# Altium project SDI-FIBER.PrjPcb
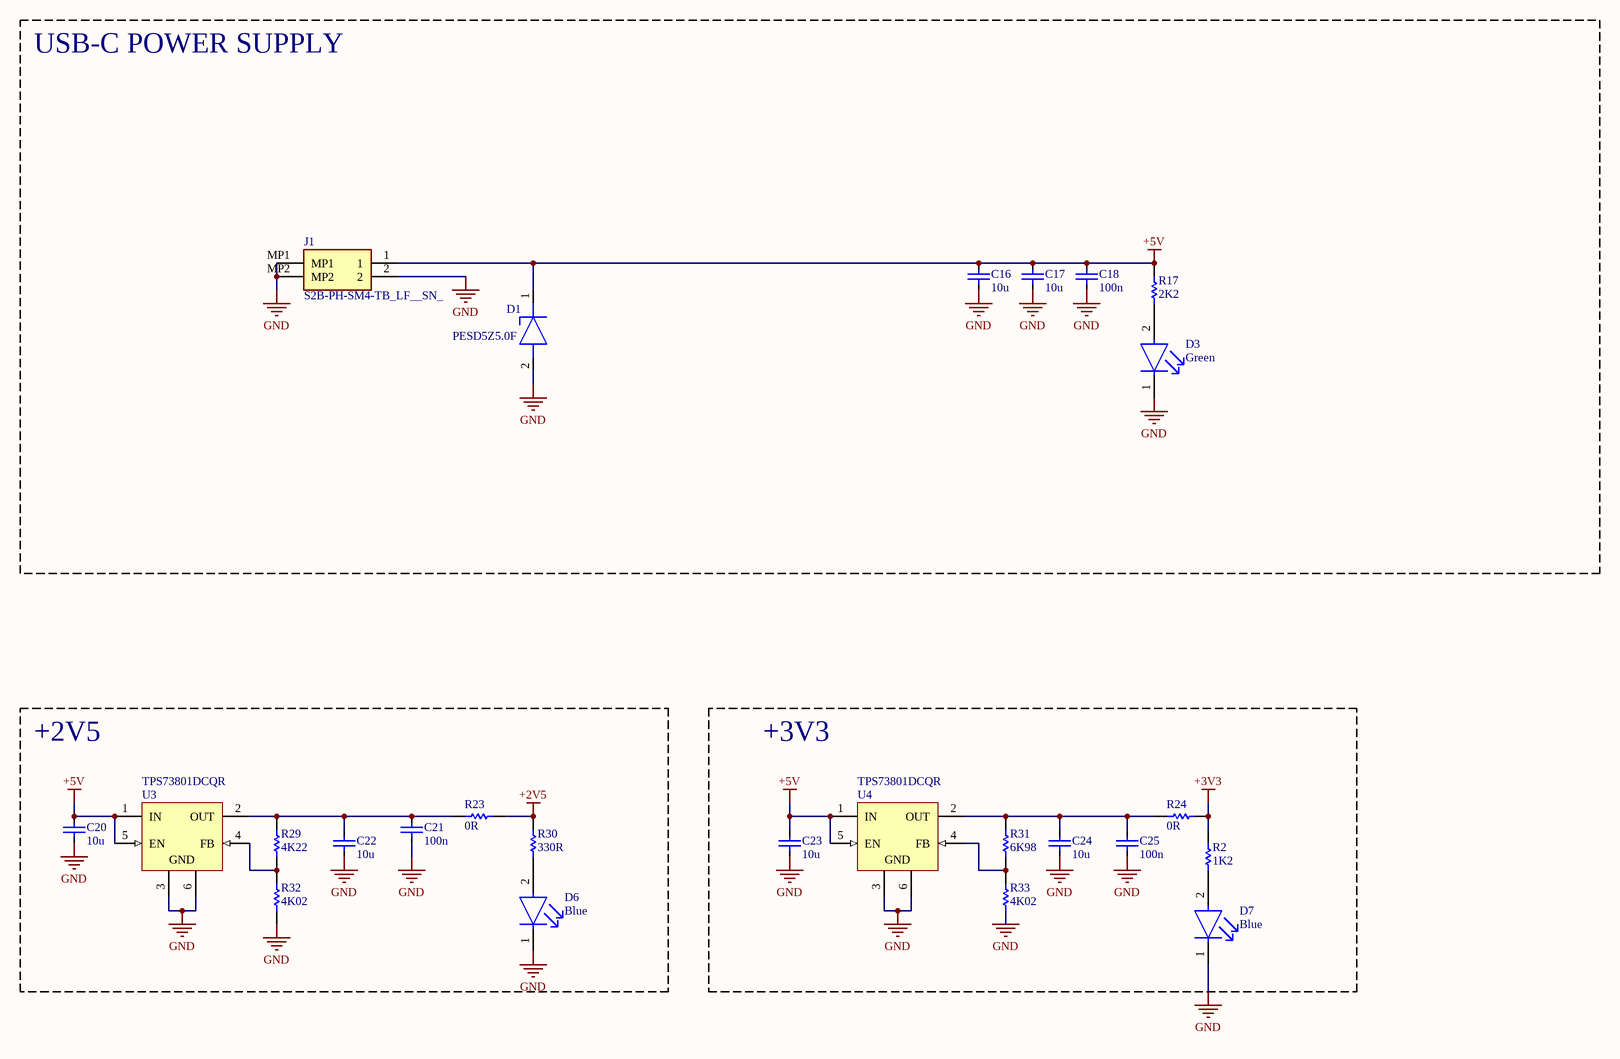
[diagram p0: POWER.SchDoc]
3 sheets, 109 parts. Net scope: global (net labels, ports and power ports of the same name join across sheets).
Board file: SDI-FIBER.PcbDoc
Sheets:
  POWER.SchDoc
  OPTIC.SchDoc
  CONVERTER.SchDoc

## Sheet POWER.SchDoc
size A3; SheetNumber: 1; SheetTotal: 3

### Parts
C16  value 10u  [FP-C1608-080-0_1-IPC_C]  (hidden comment: C1608JB0J106K080AB)
C17  value 10u  [FP-C1608-080-0_1-IPC_C]  (hidden comment: C1608JB0J106K080AB)
C18  value 100n  [FP-C1005-050-0_05-IPC_C]  (hidden comment: C1005X7R1H104K050BB)
C20  value 10u  [FP-C1608-080-0_1-IPC_C]  (hidden comment: C1608JB0J106K080AB)
C21  value 100n  [FP-C1005-050-0_05-IPC_C]  (hidden comment: C1005X7R1H104K050BB)
C22  value 10u  [FP-C1608-080-0_1-IPC_C]  (hidden comment: C1608JB0J106K080AB)
C23  value 10u  [FP-C1608-080-0_1-IPC_C]  (hidden comment: C1608JB0J106K080AB)
C24  value 10u  [FP-C1608-080-0_1-IPC_C]  (hidden comment: C1608JB0J106K080AB)
C25  value 100n  [FP-C1005-050-0_05-IPC_C]  (hidden comment: C1005X7R1H104K050BB)
D1  PESD5Z5.0F  [SODFL1608X65N]
D3  Color: Green  [FP-LTST-C191GKT-MFG]  (hidden comment: LTST-C191GKT)
D6  Color: Blue  [FP-LTST-C191TBKT-MFG]  (hidden comment: LTST-C191TBKT)
D7  Color: Blue  [FP-LTST-C191TBKT-MFG]  (hidden comment: LTST-C191TBKT)
J1  S2B-PH-SM4-TB_LF__SN_  [S2BPHSM4TBLFSN]
R2  value 1K2  [RESC1005X40X25ML05T10]  (hidden comment: RC0402FR-071K2L)
R17  value 2K2  [RESC1005X40X25NL05T10]  (hidden comment: RC0402FR-072K2L)
R23  value 0R  [RESC1005X40X25NL05T10]  (hidden comment: RC0402FR-070RL)
R24  value 0R  [RESC1005X40X25NL05T10]  (hidden comment: RC0402FR-070RL)
R29  value 4K22  [RESC1005X40X25ML05T10]  (hidden comment: RC0402FR-074K22L)
R30  value 330R  [RESC1005X40X25ML05T10]  (hidden comment: RC0402FR-07330RL)
R31  value 6K98  [RESC1005X40X25ML05T10]  (hidden comment: RC0402FR-076K98L)
R32  value 4K02  [RESC1005X40X25ML05T10]  (hidden comment: RC0402FR-074K02L)
R33  value 4K02  [RESC1005X40X25ML05T10]  (hidden comment: RC0402FR-074K02L)
U3  TPS73801DCQR  [DCQ0006A_L]
U4  TPS73801DCQR  [DCQ0006A_L]

### Blocks framed on the sheet
USB-C POWER SUPPLY: C16-C18 D1 D3 J1 R17
+2V5: C20-C22 D6 R23 R29 R30 R32 U3
+3V3: C23-C25 D7 R2 R24 R31 R33 U4

### Nets
+2V5: R23.1 R30.1
+3V3: R2.1 R24.1
+5V: C16.1 C17.1 C18.1 C20.1 C23.1 D1.1(K) J1.1 R17.1 U3.1(IN) U3.5(EN) U4.1(IN) U4.5(EN)
GND: C16.2 C17.2 C18.2 C20.2 C21.2 C22.2 C23.2 C24.2 C25.2 D1.2(A) D3.1(C) D6.1(C) D7.1(C) J1.2 J1.MP1 J1.MP2 R32.1 R33.1 U3.3(GND) U3.6(GND) U4.3(GND) U4.6(GND)
NetC21_1: C21.1 C22.1 R23.2 R29.1 U3.2(OUT)
NetC24_1: C24.1 C25.1 R24.2 R31.2 U4.2(OUT)
NetD3_2: D3.2(A) R17.2
NetD6_2: D6.2(A) R30.2
NetD7_2: D7.2(A) R2.2
NetR29_2: R29.2 R32.2 U3.4(FB)
NetR31_1: R31.1 R33.2 U4.4(FB)

### Library data of the parts
C16 C17 C20 C22-C24 = C1608JB0J106K080AB: MLCC 10μF ±10% 6.3V JB SMD 0603; Dielectric Material: Ceramic; Case Code (Imperial): 0603; Thickness: 0.035inch; Min Operating Temperature: -25°C; Termination: SMD/SMT; Lead Free: Lead Free; Resistor Type: Ceramic; Width: 0.8mm; Voltage Rating (DC): 6.3V; Package Quantity: 4000; Tolerance: 10%; Length: 0.063inch; Series: C; Height: 0.8mm; Max Operating Temperature: 85°C; Mount: Surface Mount; RoHS Compliant: Yes; Voltage Rating: 6.3V; Case Code (Metric): 1608; Case/Package: 0603; Packaging: Tape and Reel
C18 C21 C25 = C1005X7R1H104K050BB: MLCC 100nF ±10% 50V X7R SMD 0402; Dielectric Material: Ceramic; Voltage: 50V; Min Operating Temperature: -55°C; Depth: 0.5mm; Radiation Hardening: No; RoHS Compliant: Yes; Voltage Rating (DC): 50V; Lead Free: Lead Free; Resistor Type: Ceramic; Height: 0.5mm; Dielectric: X7R; Thickness: 0.022inch; Case/Package: 0402; Case Code (Metric): 1005; Termination: SMD/SMT; Packaging: Tape and Reel; Max Operating Temperature: 125°C; Mount: Surface Mount; Package Quantity: 1; Width: 0.02inch; Weight: 2.3E-05oz; Voltage Rating: 50V; Tolerance: 10%; Construction: Flat; Case Code (Imperial): 0402; Length: 1mm; REACH SVHC: No SVHC; Series: C; Part Number: C1005X7R1H104K050BB
D1 = PESD5Z5.0F: Diode ESD (Uni-directional); Manufacturer_Name: Nexperia; Datasheet Link: https://assets.nexperia.com/documents/data-sheet/PESD5Z5_0.pdf; Height: 0.65mm; Manufacturer_Part_Number: PESD5Z5.0F; Mouser Part Number: 771-PESD5Z5.0F; Mouser Price/Stock: https://www.mouser.co.uk/ProductDetail/Nexperia/PESD5Z5.0F?qs=HNBw3F7vE2wb3Eh3cMl6Jg%3D%3D; Arrow Part Number: PESD5Z5.0F; Arrow Price/Stock: https://www.arrow.com/en/products/pesd5z5.0f/nexperia?utm_currency=USD&region=nac
D3 = CMP-22017-000029-1: LED GREEN CLEAR CHIP SMD; Power Dissipation: 100mW; Lens Color: Colorless; Number of Elements: 1; Dominant Wavelength: 569nm; Forward Voltage: 2.1V; Forward Current: 30mA; Test Current: 20mA; Viewing Angle: 130°; Wavelength: 565nm; Luminous Intensity: 12mcd; Reverse Voltage: 5V; Case/Package: 0603; Package Quantity: 1; Illumination Color: Green; Lens Style: Clear; Lens Transparency: Clear; Depth: 0.8mm; Power Rating: 100mW; Width: 0.8mm; Height: 0.55mm; Radiation Hardening: No; Case Code (Imperial): 0603; Number of Pins: 2; Length: 1.6mm; Case Code (Metric): 1608; Max Operating Temperature: 85°C; Packaging: Tape and Reel; Mount: Surface Mount; Min Operating Temperature: -55°C; Lead Free: Lead Free; Number of LEDs: 1
D6 D7 = CMP-22017-000008-1: LED BLUE CLEAR CHIP SMD; Lens Color: Colorless; Dominant Wavelength: 475nm; Forward Current: 20mA; Wavelength: 468nm; Viewing Angle: 130°; Power Dissipation: 76mW; Luminous Intensity: 180mcd; Reverse Voltage: 5V; Number of Elements: 1; Lens Style: Diffused; Forward Voltage: 3.8V; Max Power Dissipation: 75mW; Case Code (Metric): 1608; Packaging: Tape and Reel; Case/Package: 0603; Depth: 1.6mm; Mount: Surface Mount; Lead Free: Lead Free; Min Operating Temperature: -20°C; Lens Transparency: Clear; Illumination Color: Blue; Height: 0.55mm; Test Current: 20mA; Case Code (Imperial): 0603; Max Operating Temperature: 80°C; Number of Pins: 2; Length: 0.8mm; Radiation Hardening: No; Package Quantity: 1; Number of LEDs: 1; Width: 0.8mm
J1 = S2B-PH-SM4-TB_LF__SN_: Connector; Manufacturer_Name: JST (JAPAN SOLDERLESS TERMINALS); Manufacturer_Part_Number: S2B-PH-SM4-TB(LF)(SN); Datasheet Link: https://www.jst-mfg.com/product/pdf/eng/ePH.pdf; Height: 6.6mm; Mouser Part Number: N/A; Mouser Price/Stock: https://www.mouser.co.uk/ProductDetail/JST-Commercial/S2B-PH-SM4-TBLFSN?qs=QpmGXVUTftEA9IU90i0xlg%3D%3D; Arrow Part Number: S2B-PH-SM4-TB(LF)(SN); Arrow Price/Stock: https://www.arrow.com/en/products/s2b-ph-sm4-tb-lf-sn/jst-manufacturing?utm_currency=USD&region=europe
R2 = CMP-2002-07456-1: Manufacturer: Yageo / Phycomp; Part Number: RC0402FR-071K2L
R17 = CMP-2002-07567-1: Manufacturer: Yageo / Phycomp; Part Number: RC0402FR-072K2L
R23 R24 = RC0402FR-070RL: Manufacturer: Yageo / Phycomp; Part Number: RC0402FR-076K98L
R29 = CMP-2002-07711-1: Manufacturer: Yageo / Phycomp; Part Number: RC0402FR-074K22L
R30 = CMP-2002-07613-1: Manufacturer: Yageo / Phycomp; Part Number: RC0402FR-07330RL
R31 = CMP-2002-07119-1: Manufacturer: Yageo / Phycomp; Part Number: RC0402FR-076K98L
R32 R33 = CMP-2002-07710-1: Manufacturer: Yageo / Phycomp; Part Number: RC0402FR-074K02L
U3 U4 = CMP-0395-00479-2: Single Output Fast Transient Response LDO, 1 A, Adjustable 1.2 to 20 V Output, 2.2 to 20 V Input, 6-pin SOT-223 (DCQ), -40 to 125 degC, Green (RoHS & no Sb/Br); Manufacturer: Texas Instruments; Vdo(Typ)(mV): 300; SubFamily: Single Channel LDO; Vin(Min)(V): 2.2; Vin(Max)(V): 20; Iout(Max)(A): 1; Vout Adj(Min)(V): 1.2; Mounting Technology: Surface Mount; PackageVersion: 4202109/D; ComponentLink1URL: http://www.ti.com/; ComponentLink3URL: http://www.ti.com/litv/pdf/mpds098c; Eco-Plan: Green (RoHS & no Sb/Br); ComponentLink2URL: http://www.ti.com/general/docs/lit/getliterature.tsp?genericPartNumber=TPS73801&fileType=pdf; ComponentLink3Description: Package Specification; Vout Adj(Max)(V): 20; PackageReference: DCQ0006A; ComponentLink1Description: Manufacturer URL; ComponentLink2Description: Datasheet; Iq(Typ)(mA): 1; DatasheetVersion: SLVS915A; PackageDescription: 6-Pin Plastic Small Outline, Body 3.5 x 6.5 mm, Pitch 1.27 mm; PartNumber: TPS73801DCQR

## Sheet OPTIC.SchDoc
size A3; SheetNumber: 2; SheetTotal: 3
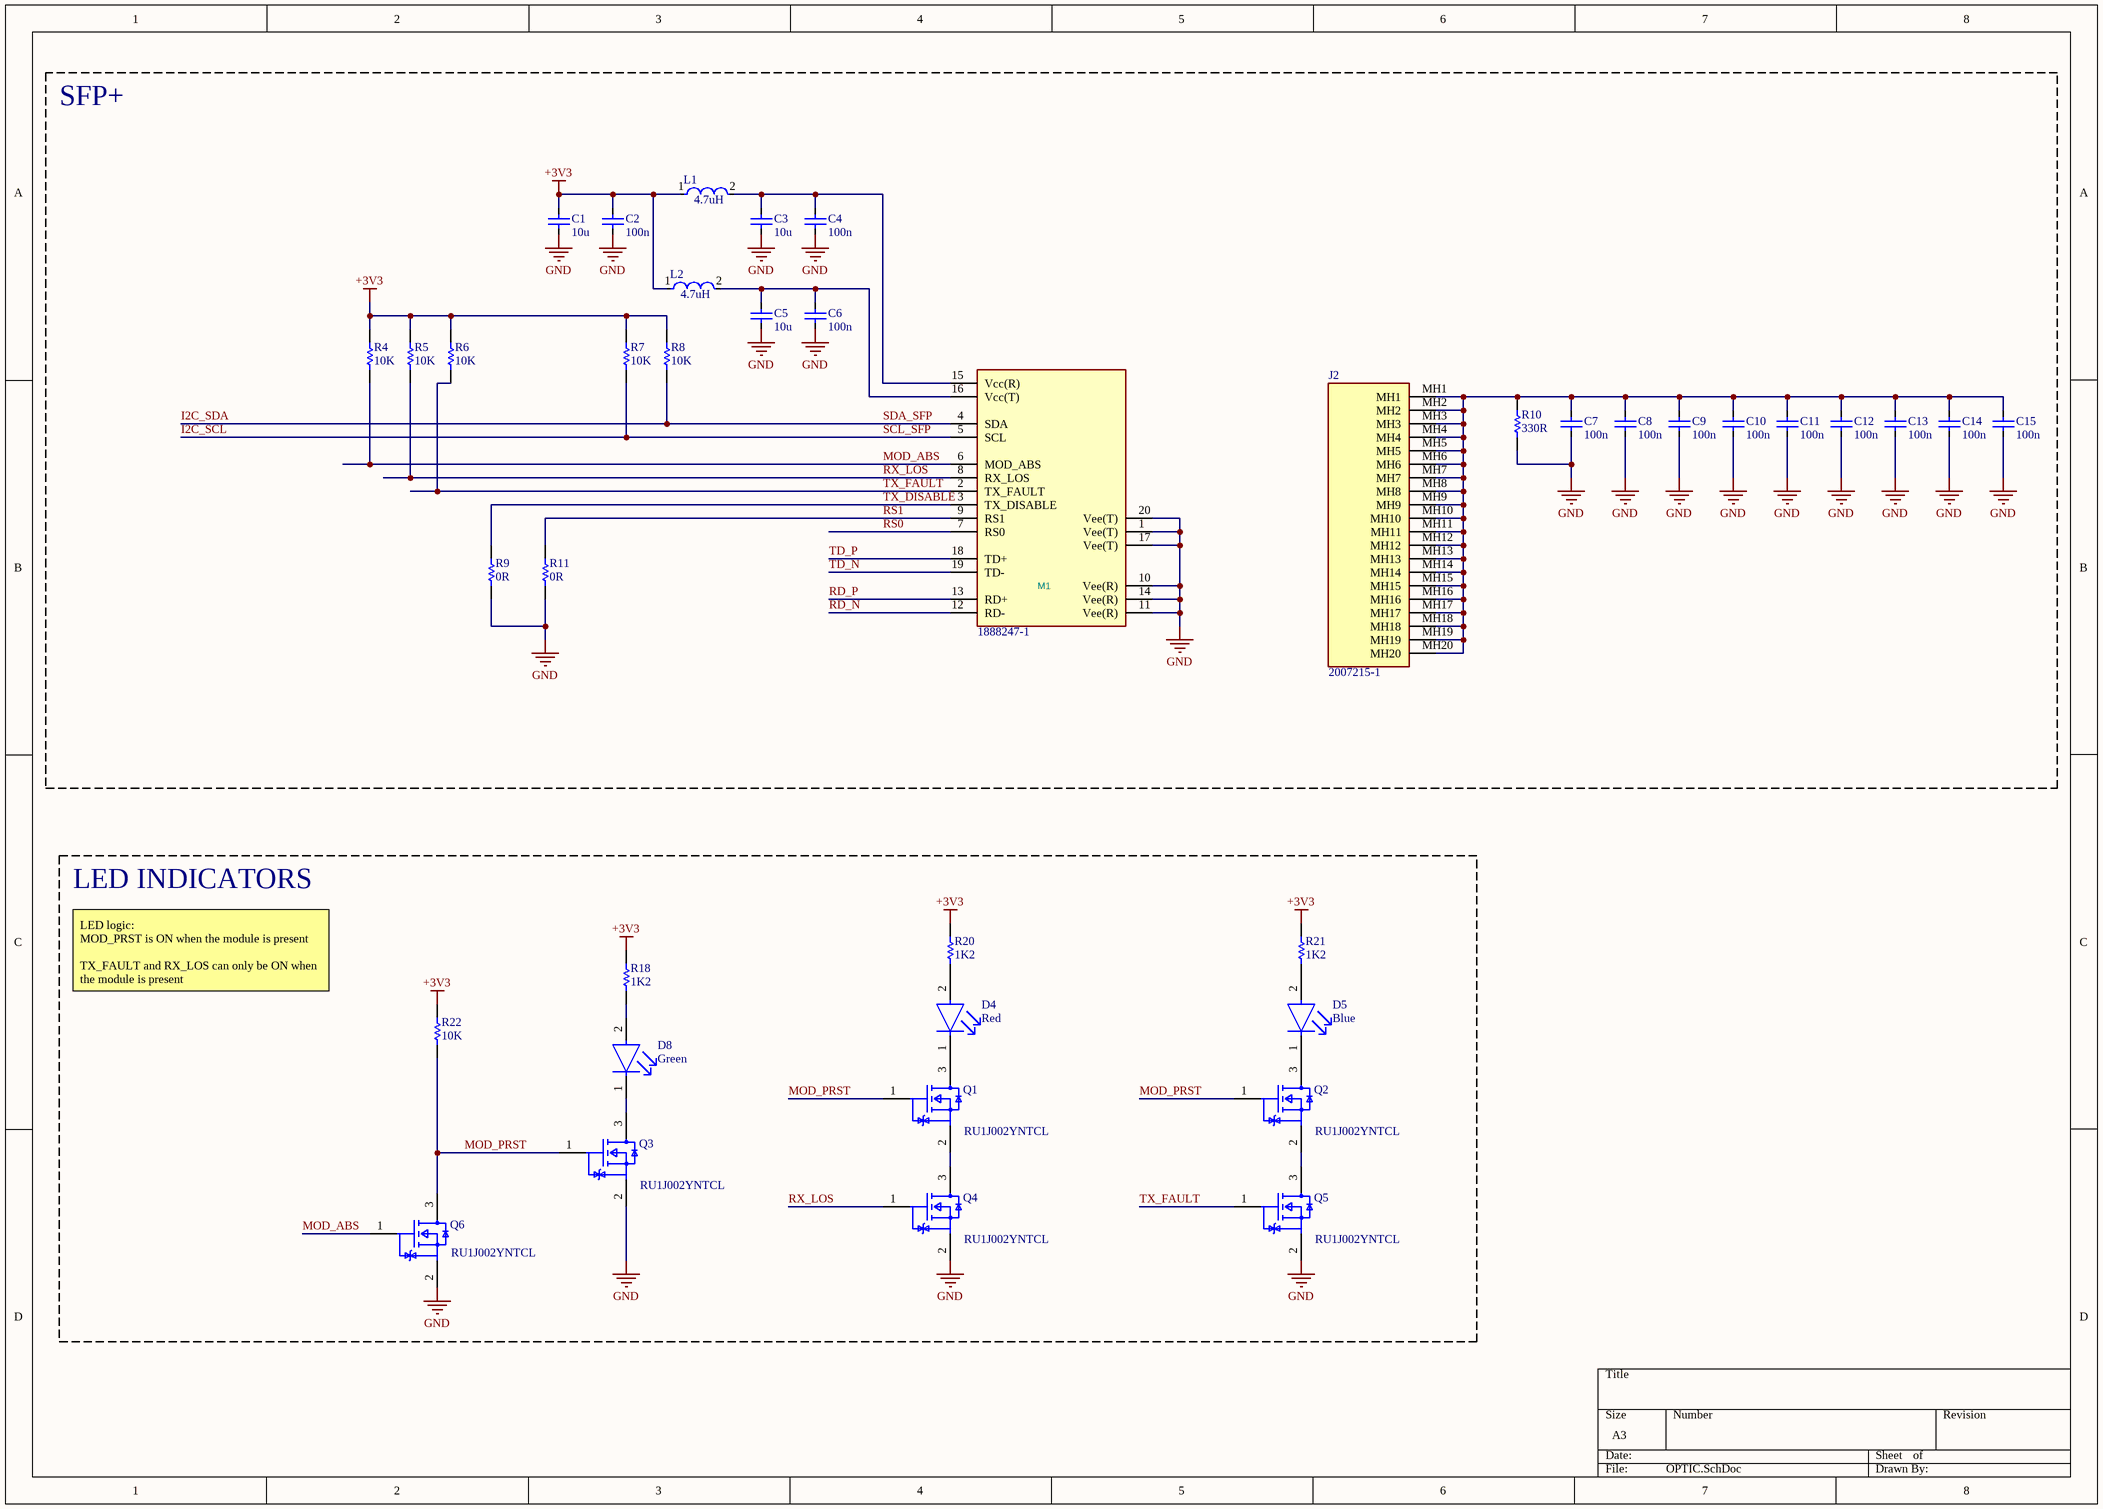
[diagram p1: OPTIC.SchDoc]

### Parts
C1  value 10u  [FP-C1608-080-0_1-IPC_C]  (hidden comment: C1608JB0J106K080AB)
C2  value 100n  [FP-C1005-050-0_05-IPC_C]  (hidden comment: C1005X7R1H104K050BB)
C3  value 10u  [FP-C1608-080-0_1-IPC_C]  (hidden comment: C1608JB0J106K080AB)
C4  value 100n  [FP-C1005-050-0_05-IPC_C]  (hidden comment: C1005X7R1H104K050BB)
C5  value 10u  [FP-C1608-080-0_1-IPC_C]  (hidden comment: C1608JB0J106K080AB)
C6  value 100n  [FP-C1005-050-0_05-IPC_C]  (hidden comment: C1005X7R1H104K050BB)
C7  value 100n  [FP-C1005-050-0_05-IPC_C]  (hidden comment: C1005X7R1H104K050BB)
C8  value 100n  [FP-C1005-050-0_05-IPC_C]  (hidden comment: C1005X7R1H104K050BB)
C9  value 100n  [FP-C1005-050-0_05-IPC_C]  (hidden comment: C1005X7R1H104K050BB)
C10  value 100n  [FP-C1005-050-0_05-IPC_C]  (hidden comment: C1005X7R1H104K050BB)
C11  value 100n  [FP-C1005-050-0_05-IPC_C]  (hidden comment: C1005X7R1H104K050BB)
C12  value 100n  [FP-C1005-050-0_05-IPC_C]  (hidden comment: C1005X7R1H104K050BB)
C13  value 100n  [FP-C1005-050-0_05-IPC_C]  (hidden comment: C1005X7R1H104K050BB)
C14  value 100n  [FP-C1005-050-0_05-IPC_C]  (hidden comment: C1005X7R1H104K050BB)
C15  value 100n  [FP-C1005-050-0_05-IPC_C]  (hidden comment: C1005X7R1H104K050BB)
D4  Color: Red  [FP-LTST-C191KRKT-MFG]  (hidden comment: LTST-C191KRKT)
D5  Color: Blue  [FP-LTST-C191TBKT-MFG]  (hidden comment: LTST-C191TBKT)
D8  Color: Green  [FP-LTST-C191GKT-MFG]  (hidden comment: LTST-C191GKT)
J2  2007215-1  [2007215-1]
L1  Inductance: 4.7uH  [FP-DFE252012C-IPC_C]  (hidden comment: DFE252012P-4R7M=P2)
L2  Inductance: 4.7uH  [FP-DFE252012C-IPC_C]  (hidden comment: DFE252012P-4R7M=P2)
M1  1888247-1  [1888247-1]
Q1  RU1J002YNTCL  [FP-UMT3F-MFG]
Q2  RU1J002YNTCL  [FP-UMT3F-MFG]
Q3  RU1J002YNTCL  [FP-UMT3F-MFG]
Q4  RU1J002YNTCL  [FP-UMT3F-MFG]
Q5  RU1J002YNTCL  [FP-UMT3F-MFG]
Q6  RU1J002YNTCL  [FP-UMT3F-MFG]
R4  value 10K  [RESC1005X40X25LL05T10]  (hidden comment: RC0402FR-0710KL)
R5  value 10K  [RESC1005X40X25LL05T10]  (hidden comment: RC0402FR-0710KL)
R6  value 10K  [RESC1005X40X25LL05T10]  (hidden comment: RC0402FR-0710KL)
R7  value 10K  [RESC1005X40X25LL05T10]  (hidden comment: RC0402FR-0710KL)
R8  value 10K  [RESC1005X40X25LL05T10]  (hidden comment: RC0402FR-0710KL)
R9  value 0R  [RESC1005X40X25LL05T10]  (hidden comment: RC0402FR-070RL)
R10  value 330R  [RESC1005X40X25LL05T10]  (hidden comment: RC0402FR-07330RL)
R11  value 0R  [RESC1005X40X25LL05T10]  (hidden comment: RC0402FR-070RL)
R18  value 1K2  [RESC1005X40X25ML05T10]  (hidden comment: RC0402FR-071K2L)
R20  value 1K2  [RESC1005X40X25ML05T10]  (hidden comment: RC0402FR-071K2L)
R21  value 1K2  [RESC1005X40X25ML05T10]  (hidden comment: RC0402FR-071K2L)
R22  value 10K  [RESC1005X40X25LL05T10]  (hidden comment: RC0402FR-0710KL)

### Blocks framed on the sheet
SFP+: C1-C15 J2 L1 L2 M1 R4-R11
LED INDICATORS: D4 D5 D8 Q1-Q6 R18 R20-R22

### Nets
+3V3: C1.1 C2.1 L1.1 L2.1 R4.1 R5.1 R6.1 R7.1 R8.1 R18.1 R20.1 R21.1 R22.1
GND: C1.2 C2.2 C3.2 C4.2 C5.2 C6.2 C7.2 C8.2 C9.2 C10.2 C11.2 C12.2 C13.2 C14.2 C15.2 M1.1(Vee(T)) M1.10(Vee(R)) M1.11(Vee(R)) M1.14(Vee(R)) M1.17(Vee(T)) M1.20(Vee(T)) Q3.2(S) Q4.2(S) Q5.2(S) Q6.2(S) R9.2 R10.2 R11.2
I2C_SCL: M1.5(SCL) R7.2  [also labelled SCL_SFP]
I2C_SDA: M1.4(SDA) R8.2  [also labelled SDA_SFP]
MOD_ABS: M1.6(MOD_ABS) Q6.1(G) R4.2
MOD_PRST: Q1.1(G) Q2.1(G) Q3.1(G) Q6.3(D) R22.2
RD_N: M1.12(RD-)
RD_P: M1.13(RD+)
RS0: M1.7(RS0)
RS1: M1.9(RS1) R11.1
RX_LOS: M1.8(RX_LOS) Q4.1(G) R5.2
TD_N: M1.19(TD-)
TD_P: M1.18(TD+)
TX_DISABLE: M1.3(TX_DISABLE) R9.1
TX_FAULT: M1.2(TX_FAULT) Q5.1(G) R6.2
NetC3_1: C3.1 C4.1 L1.2 M1.15(Vcc(R))
NetC5_1: C5.1 C6.1 L2.2 M1.16(Vcc(T))
NetC7_1: C7.1 C8.1 C9.1 C10.1 C11.1 C12.1 C13.1 C14.1 C15.1 J2.MH1 J2.MH2 J2.MH3 J2.MH4 J2.MH5 J2.MH6 J2.MH7 J2.MH8 J2.MH9 J2.MH10 J2.MH11 J2.MH12 J2.MH13 J2.MH14 J2.MH15 J2.MH16 J2.MH17 J2.MH18 J2.MH19 J2.MH20 R10.1
NetD4_1: D4.1(C) Q1.3(D)
NetD4_2: D4.2(A) R20.2
NetD5_1: D5.1(C) Q2.3(D)
NetD5_2: D5.2(A) R21.2
NetD8_1: D8.1(C) Q3.3(D)
NetD8_2: D8.2(A) R18.2
NetQ1_2: Q1.2(S) Q4.3(D)
NetQ2_2: Q2.2(S) Q5.3(D)

### Notes on the sheet
- LED logic:
  MOD_PRST is ON when the module is present
  TX_FAULT and RX_LOS can only be ON when the module is present

### Library data of the parts
C1 C3 C5 = C1608JB0J106K080AB: as C16 on sheet POWER; Case Code (Imperial): 0603; Thickness: 0.035inch; Min Operating Temperature: -25°C; Termination: SMD/SMT; Lead Free: Lead Free; Resistor Type: Ceramic; Width: 0.8mm; Voltage Rating (DC): 6.3V; Package Quantity: 4000; Tolerance: 10%; Length: 0.063inch; Series: C; Height: 0.8mm; Max Operating Temperature: 85°C; Mount: Surface Mount; RoHS Compliant: Yes; Voltage Rating: 6.3V; Case Code (Metric): 1608; Case/Package: 0603; Packaging: Tape and Reel
C2 C4 C6-C15 = C1005X7R1H104K050BB: as C18 on sheet POWER; Voltage: 50V; Min Operating Temperature: -55°C; Depth: 0.5mm; Radiation Hardening: No; RoHS Compliant: Yes; Voltage Rating (DC): 50V; Lead Free: Lead Free; Resistor Type: Ceramic; Height: 0.5mm; Dielectric: X7R; Thickness: 0.022inch; Case/Package: 0402; Case Code (Metric): 1005; Termination: SMD/SMT; Packaging: Tape and Reel; Max Operating Temperature: 125°C; Mount: Surface Mount; Package Quantity: 1; Width: 0.02inch; Weight: 2.3E-05oz; Voltage Rating: 50V; Tolerance: 10%; Construction: Flat; Case Code (Imperial): 0402; Length: 1mm; REACH SVHC: No SVHC; Series: C; Part Number: C1005X7R1H104K050BB
D4 = CMP-2000-05199-2: NexarPartId: 549908; Lens Transparency: Clear; Luminous Intensity: 54mcd; Current: 2A; Forward Current: 20mA; Number of Elements: 1; Power Rating: 75mW; Lens Color: Colorless; Wavelength: 639nm; Viewing Angle: 130°; Voltage: 2V; Dominant Wavelength: 631nm; Reverse Voltage: 5V; Illumination Color: Red; Height: 550µm; Length: 1.6mm; Number of Pins: 2; Packaging: Tape and Reel; Mount: Surface Mount; Case Code (Metric): 1608; Radiation Hardening: No; Case Code (Imperial): 0603; Test Current: 20mA; Number of LEDs: 1; Schedule B: 8541402000, 8541402000; Lead Free: Lead Free; Power Dissipation: 75mW; RoHS: Compliant; Forward Voltage: 2V; Lens Style: Clear; Max Operating Temperature: 85°C; Depth: 800µm; Width: 800µm; Min Operating Temperature: -55°C; Case/Package: 0603
D5 = CMP-22017-000008-1: as D6 on sheet POWER; Case Code (Metric): 1608; Packaging: Tape and Reel; Case/Package: 0603; Depth: 1.6mm; Mount: Surface Mount; Lead Free: Lead Free; Min Operating Temperature: -20°C; Lens Transparency: Clear; Illumination Color: Blue; Height: 0.55mm; Test Current: 20mA; Case Code (Imperial): 0603; Max Operating Temperature: 80°C; Number of Pins: 2; Length: 0.8mm; Radiation Hardening: No; Package Quantity: 1; Number of LEDs: 1; Width: 0.8mm
D8 = CMP-22017-000029-1: as D3 on sheet POWER; Case/Package: 0603; Package Quantity: 1; Illumination Color: Green; Lens Style: Clear; Lens Transparency: Clear; Depth: 0.8mm; Power Rating: 100mW; Width: 0.8mm; Height: 0.55mm; Radiation Hardening: No; Case Code (Imperial): 0603; Number of Pins: 2; Length: 1.6mm; Case Code (Metric): 1608; Max Operating Temperature: 85°C; Packaging: Tape and Reel; Mount: Surface Mount; Min Operating Temperature: -55°C; Lead Free: Lead Free; Number of LEDs: 1
J2 = 2007215-1: Position SFP+ Cage Connector Press-Fit Through Hole
L1 L2 = CMP-06042-011776-1: Shielded Wirewound Inductor 4.7uH 20% 1400mA 0.2Ω 1008 (2520); Core Material: Ferrite; Test Frequency: 1MHz; DC Resistance (DCR): 200mR; Max DC Current: 1.4A; Current Rating: 2A; Case Code (Metric): 2520; Case Code (Imperial): 1008; Mount: Surface Mount; Packaging: Tape and Reel; Depth: 2mm; Length: 0.098inch; Case/Package: 1008; Max Operating Temperature: 125°C; Shielding: Shielded; Width: 0.079inch; Height - Seated (Max): 0.047inch; Tolerance: 20%; Min Operating Temperature: -40°C; Resistor Type: Wirewound
M1 = 1888247-1: SFP+, Connector, .8mm [.031in] Centerline, Power & Signal, Operating Temperature Range -55 – 85 °C [-67 – 185 °F], Data Rate (Max) 16Gb/sec; Manufacturer: TE Connectivity (TE; License: Apache-2.0; Author: Parsa Malekpor; Value: 1888247-1; Part Number: 1888247-1
Q1-Q6 = RU1J002YNTCL: MOSFET N-CH 50V 0.2A UMT3F; Manufacturer: Rohm; Drain To Source Resistance: 1.6Ω; Depletion Mode: False; Continuous Drain Current: 200mA; Pulse Drain Current: 800mA; Turn On Delay Time: 5ns; Threshold Vgs Max: 0.8V; Rthja Max: 833°C/W; Max Forward Diode Voltage: 1.2V; Max Junction Temp: +150°C; Standoff Height: 0mm; Input Capacitace At Vds: 26pF @ 10V; Number Of Channels: 1; Power Dissipation: 150mW; Gate To Source Voltage: 8V; Turn Off Delay Time: 17ns; Threshold Vgs Min: 0.3V; Lead Free: Yes; Device Class L3: MOSFETs; Drain To Source Voltage: 50V; ComponentLink2URL: https://d1d2qsbl8m0m72.cloudfront.net/en/products/databook/datasheet/discrete/transistor/mosfet/ru1j002yn-e.pdf; RoHS: TRUE; Device Class L2: Transistors; Mouser Description: MOSFET 0.9V Drive Nch MOSFET; Category: Trans; Octopart: https://octopart.com/ru1j002yntcl-rohm-47197697; Temperature: to +150°C; Height: 1.05mm; Number Of N Channels: 1; Package: UMT3F; ComponentLink2Description: Datasheet; Automotive: No; Drain To Source Breakdown Voltage: 50V; Device Class L1: Discrete Semiconductors; Digikey Description: MOSFET N-CH 50V 0.2A UMT3F; Manufacturer Part Number: RU1J002YNTCL; Temperature Range High: +150°C
R4-R9 R11 R22 = CMP-2002-07353-1: Manufacturer: Yageo / Phycomp
  R4-R8 R22: Part Number: RC0402FR-0710KL
  R9 R11: Part Number: RC0402FR-070RL
R10 = CMP-2002-07613-1: Manufacturer: Yageo / Phycomp; Part Number: RC0402FR-07330RL
R18 R20 R21 = CMP-2002-07456-1: Manufacturer: Yageo / Phycomp; Part Number: RC0402FR-071K2L

## Sheet CONVERTER.SchDoc
size A3; SheetNumber: 3; SheetTotal: 3
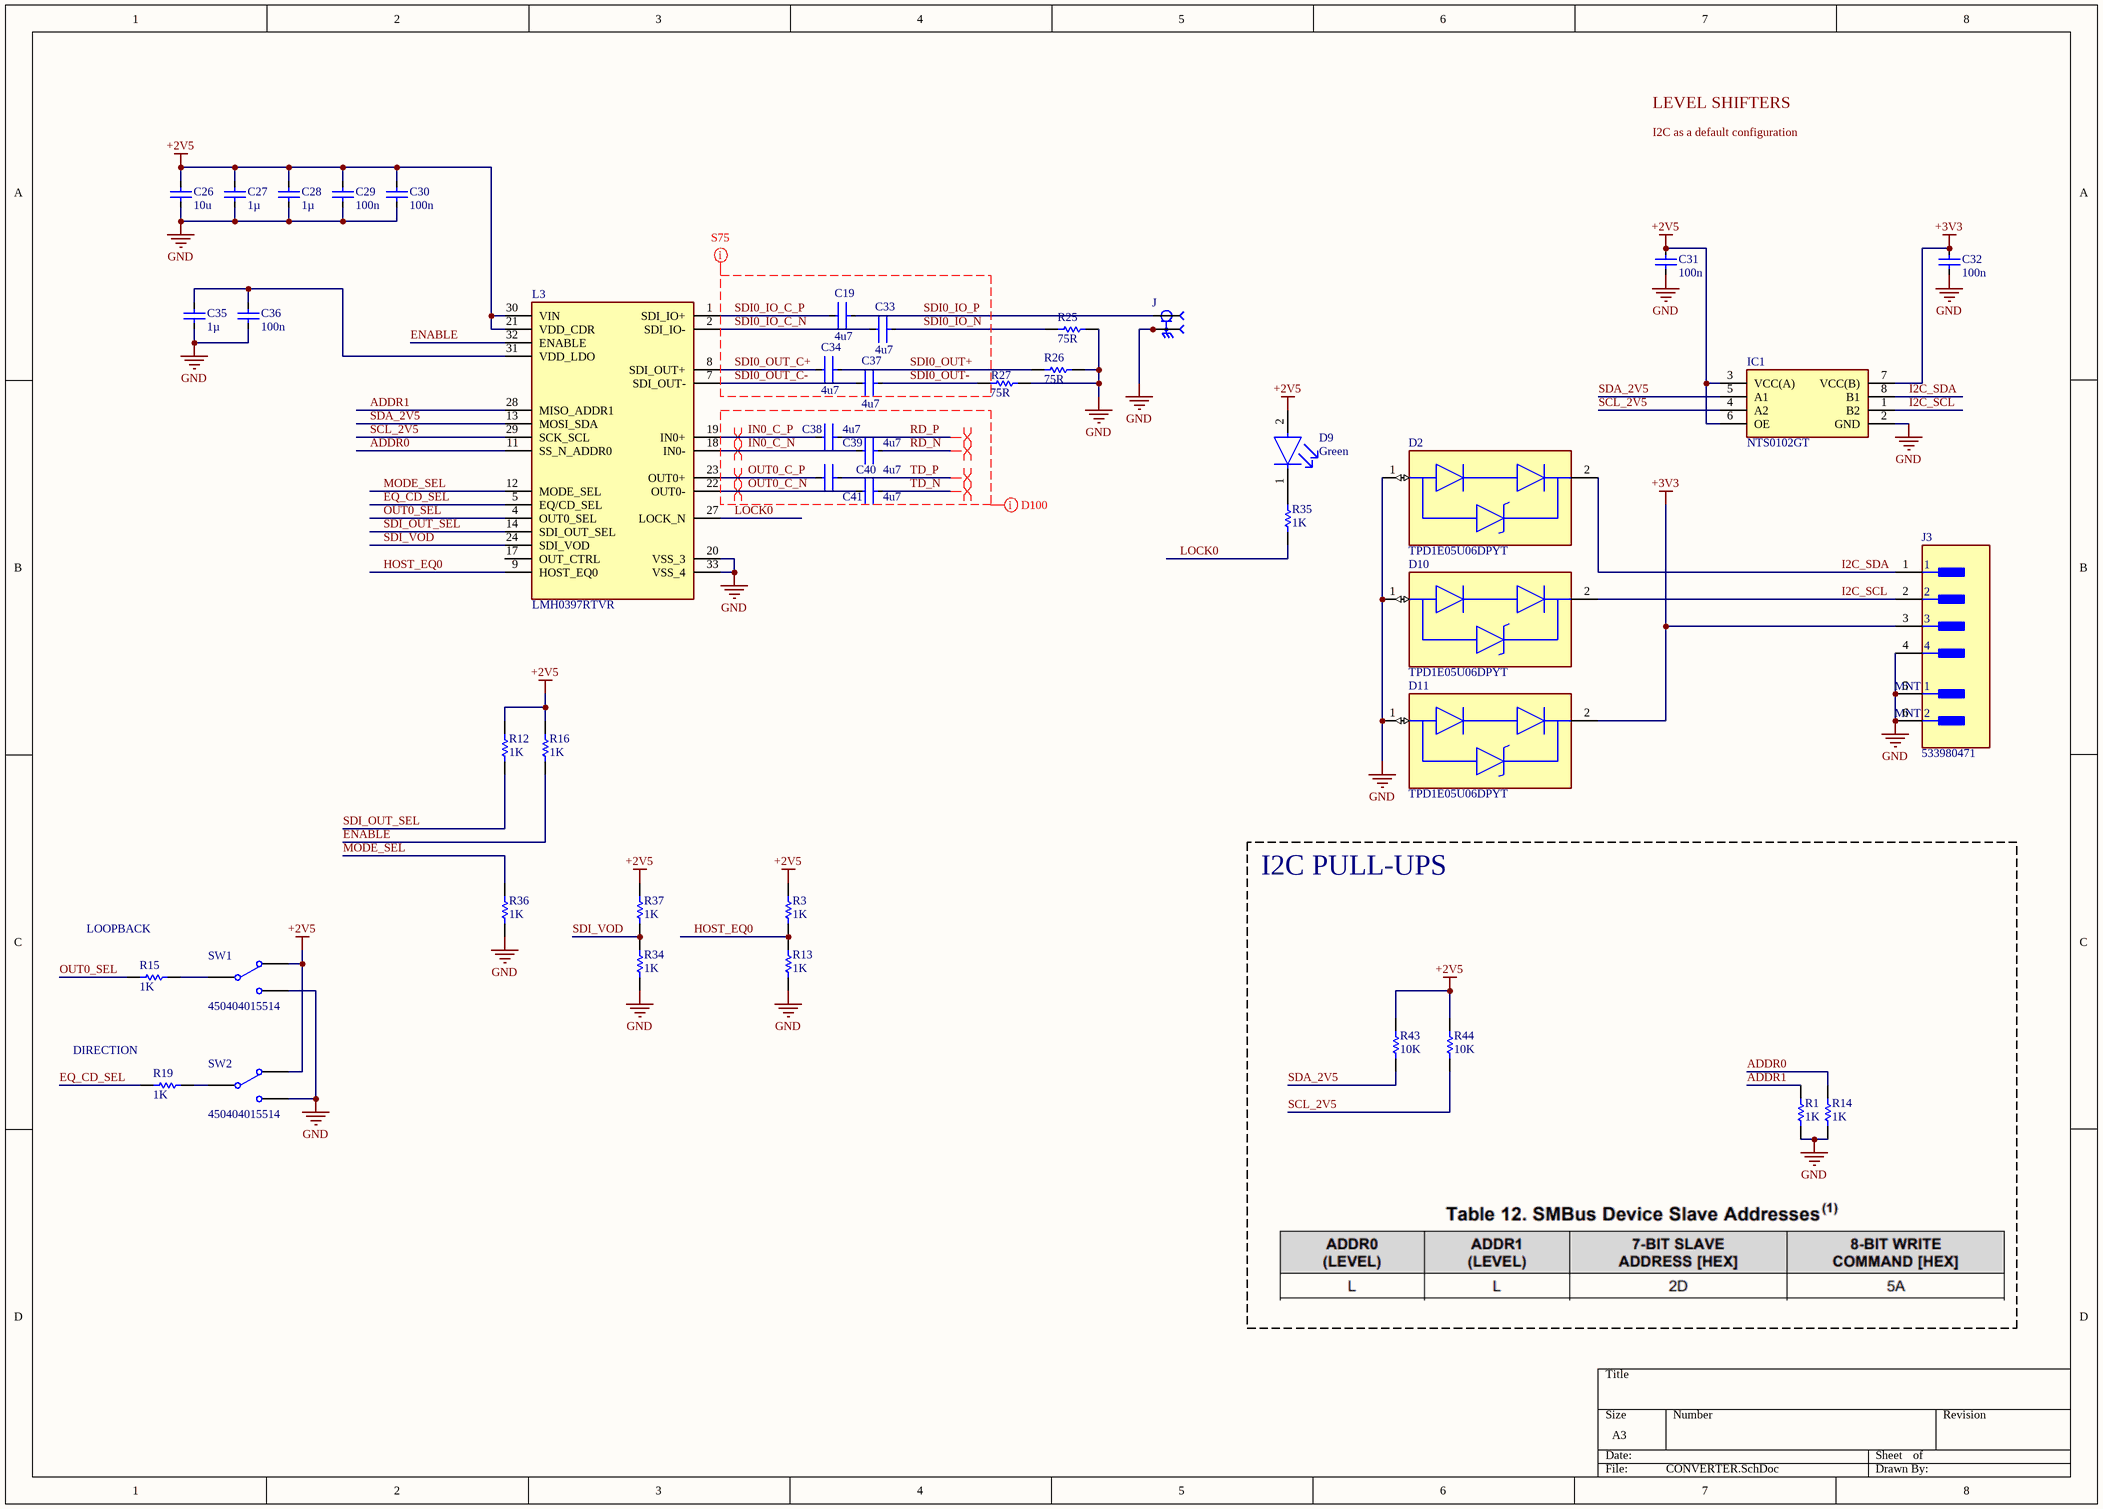
[diagram p2: CONVERTER.SchDoc]

### Parts
C19  value 4u7  [FP-GRM155-0_1-MFG]  (hidden comment: GRM155R60J475ME47D)
C26  value 10u  [FP-C1608-080-0_1-IPC_C]  (hidden comment: C1608JB0J106K080AB)
C27  value 1µ  [CAPC1005X55X10NL05]  (hidden comment: C1005X5R1A105K050BB)
C28  value 1µ  [CAPC1005X55X10NL05]  (hidden comment: C1005X5R1A105K050BB)
C29  value 100n  [FP-C1005-050-0_05-IPC_C]  (hidden comment: C1005X7R1H104K050BB)
C30  value 100n  [FP-C1005-050-0_05-IPC_C]  (hidden comment: C1005X7R1H104K050BB)
C31  value 100n  [FP-C1005-050-0_05-IPC_C]  (hidden comment: C1005X7R1H104K050BB)
C32  value 100n  [FP-C1005-050-0_05-IPC_C]  (hidden comment: C1005X7R1H104K050BB)
C33  value 4u7  [FP-GRM155-0_1-MFG]  (hidden comment: GRM155R60J475ME47D)
C34  value 4u7  [FP-GRM155-0_1-MFG]  (hidden comment: GRM155R60J475ME47D)
C35  value 1µ  [CAPC1005X55X10NL05]  (hidden comment: C1005X5R1A105K050BB)
C36  value 100n  [FP-C1005-050-0_05-IPC_C]  (hidden comment: C1005X7R1H104K050BB)
C37  value 4u7  [FP-GRM155-0_1-MFG]  (hidden comment: GRM155R60J475ME47D)
C38  value 4u7  [FP-GRM155-0_1-IPC_B]  (hidden comment: GRM155R60J475ME47D)
C39  value 4u7  [FP-GRM155-0_1-IPC_B]  (hidden comment: GRM155R60J475ME47D)
C40  value 4u7  [FP-GRM155-0_1-IPC_B]  (hidden comment: GRM155R60J475ME47D)
C41  value 4u7  [FP-GRM155-0_1-IPC_B]  (hidden comment: GRM155R60J475ME47D)
D2  TPD1E05U06DPYT  [FP-DPY0002A-MFG]
D9  Color: Green  [FP-LTST-C191GKT-MFG]  (hidden comment: LTST-C191GKT)
D10  TPD1E05U06DPYT  [FP-DPY0002A-MFG]
D11  TPD1E05U06DPYT  [FP-DPY0002A-MFG]
IC1  NTS0102GT  [NTS0102GT]
J  BNC7T-J-P-XX-ST-EM1D  [SAMTEC_BNC7T-J-P-XX-ST-EM1D]  (value not drawn)
J3  533980471  [FP-533980471-MFG]
L3  LMH0397RTVR  [QFN50P500X500X80-33N-D]
R1  value 1K  [RESC1005X40X25LL05T10]  (hidden comment: RC0402FR-071KL)
R3  value 1K  [RESC1005X40X25LL05T10]  (hidden comment: RC0402FR-071KL)
R12  value 1K  [RESC1005X40X25LL05T10]  (hidden comment: RC0402FR-071KL)
R13  value 1K  [RESC1005X40X25LL05T10]  (hidden comment: RC0402FR-071KL)
R14  value 1K  [RESC1005X40X25LL05T10]  (hidden comment: RC0402FR-071KL)
R15  value 1K  [RESC1005X40X25LL05T10]  (hidden comment: RC0402FR-071KL)
R16  value 1K  [RESC1005X40X25LL05T10]  (hidden comment: RC0402FR-071KL)
R19  value 1K  [RESC1005X40X25LL05T10]  (hidden comment: RC0402FR-071KL)
R25  value 75R  [RESC1005X40X25LL05T10]  (hidden comment: RC0402FR-0775RL)
R26  value 75R  [RESC1005X40X25LL05T10]  (hidden comment: RC0402FR-0775RL)
R27  value 75R  [RESC1005X40X25LL05T10]  (hidden comment: RC0402FR-0775RL)
R34  value 1K  [RESC1005X40X25LL05T10]  (hidden comment: RC0402FR-071KL)
R35  value 1K  [RESC1005X40X25LL05T10]  (hidden comment: RC0402FR-071KL)
R36  value 1K  [RESC1005X40X25LL05T10]  (hidden comment: RC0402FR-071KL)
R37  value 1K  [RESC1005X40X25LL05T10]  (hidden comment: RC0402FR-071KL)
R43  value 10K  [RESC1005X40X25LL05T10]  (hidden comment: RC0402FR-0710KL)
R44  value 10K  [RESC1005X40X25LL05T10]  (hidden comment: RC0402FR-0710KL)
SW1  450404015514  [450404015514]
SW2  450404015514  [450404015514]

### Blocks framed on the sheet
I2C PULL-UPS: R1 R14 R43 R44

### Nets
+2V5: C26.1 C27.1 C28.1 C29.1 C30.1 C31.1 D9.2(A) IC1.3(VCC(A)) IC1.6(OE) L3.21(VDD_CDR) L3.30(VIN) R3.1 R12.1 R16.1 R37.1 R43.1 R44.1 SW1.L1 SW2.L1
+3V3: C32.1 D11.2(GND) IC1.7(VCC(B)) J3.3
GND: C26.2 C27.2 C28.2 C29.2 C30.2 C31.2 C32.2 C35.2 C36.2 D2.1(I/O) D10.1(I/O) D11.1(I/O) IC1.2(GND) J.S1 J.S2 J.S3 J.S4 J3.4 J3.5(MNT_1) J3.6(MNT_2) L3.20(VSS_3) L3.33(VSS_4) R1.2 R13.2 R14.2 R25.2 R26.2 R27.2 R34.2 R36.2 SW1.L2 SW2.L2
ADDR0: L3.11(SS_N_ADDR0) R14.1
ADDR1: L3.28(MISO_ADDR1) R1.1
ENABLE: L3.32(ENABLE) R16.2
EQ_CD_SEL: L3.5(EQ/CD_SEL) R19.1
HOST_EQ0: L3.9(HOST_EQ0) R3.2 R13.1
I2C_SCL: D10.2(GND) IC1.1(B2) J3.2
I2C_SDA: D2.2(GND) IC1.8(B1) J3.1
IN0_C_N: C39.2 L3.18(IN0-)
IN0_C_P: C38.2 L3.19(IN0+)
LOCK0: L3.27(LOCK_N) R35.2
MODE_SEL: L3.12(MODE_SEL) R36.1
OUT0_C_N: C41.2 L3.22(OUT0-)
OUT0_C_P: C40.2 L3.23(OUT0+)
OUT0_SEL: L3.4(OUT0_SEL) R15.1
RD_N: C39.1
RD_P: C38.1
SCL_2V5: IC1.4(A2) L3.29(SCK_SCL) R44.2
SDA_2V5: IC1.5(A1) L3.13(MOSI_SDA) R43.2
SDI0_IO_C_N: C33.2 L3.2(SDI_IO-)
SDI0_IO_C_P: C19.2 L3.1(SDI_IO+)
SDI0_IO_N: C33.1 R25.1
SDI0_IO_P: C19.1 J.1
SDI0_OUT+: C34.1 R26.1
SDI0_OUT-: C37.1 R27.1
SDI0_OUT_C+: C34.2 L3.8(SDI_OUT+)
SDI0_OUT_C-: C37.2 L3.7(SDI_OUT-)
SDI_OUT_SEL: L3.14(SDI_OUT_SEL) R12.2
SDI_VOD: L3.24(SDI_VOD) R34.1 R37.2
TD_N: C41.1
TD_P: C40.1
NetC35_1: C35.1 C36.1 L3.31(VDD_LDO)
NetD9_1: D9.1(C) R35.1
NetR15_2: R15.2 SW1.COM
NetR19_2: R19.2 SW2.COM

Not connected (* = marked no-connect by the designer): L3 17(OUT_CTRL)

### Layout directives
differential pair: IN0_C_N, IN0_C_P, OUT0_C_N, OUT0_C_P, RD_N, RD_P, TD_N, TD_P
net class SDI: SDI0_IO_C_N, SDI0_IO_C_P, SDI0_IO_N, SDI0_IO_P, SDI0_OUT+, SDI0_OUT-, SDI0_OUT_C+, SDI0_OUT_C-
net class D100: IN0_C_N, IN0_C_P, OUT0_C_N, OUT0_C_P, RD_N, RD_P, TD_N, TD_P

### Notes on the sheet
- (near R15) LOOPBACK
- (near R19) DIRECTION
- Labels drawn without touching a wire or pin: I2C as a default configuration, LEVEL SHIFTERS

### Library data of the parts
C19 C33 C34 C37-C41 = CMP-2008-04549-2: Chip Multilayer Ceramic Capacitors for General Purpose, 0402, 4.7uF, X5R, 15%, 20%, 6.3V; Height: 0.5mm; Weight: 0.000212oz; Length: 1mm; Case Code (Metric): 1005; Packaging: Tape and Reel; Termination: SMD/SMT; Dielectric: X5R; Depth: 0.5mm; Case Code (Imperial): 0402; Min Operating Temperature: -55°C; Case/Package: 0402; Voltage: 6.3V; Width: 0.02inch; Lead Free: Lead Free; Thickness: 0.022inch; Contact Plating: Tin; REACH SVHC: No SVHC; Package Quantity: 10000; Tolerance: 20%; Voltage Rating (DC): 6.3V; Voltage Rating: 6.3V; Mount: Surface Mount; Max Operating Temperature: 85°C
C26 = C1608JB0J106K080AB: as C16 on sheet POWER; Case Code (Imperial): 0603; Thickness: 0.035inch; Min Operating Temperature: -25°C; Termination: SMD/SMT; Lead Free: Lead Free; Resistor Type: Ceramic; Width: 0.8mm; Voltage Rating (DC): 6.3V; Package Quantity: 4000; Tolerance: 10%; Length: 0.063inch; Series: C; Height: 0.8mm; Max Operating Temperature: 85°C; Mount: Surface Mount; RoHS Compliant: Yes; Voltage Rating: 6.3V; Case Code (Metric): 1608; Case/Package: 0603; Packaging: Tape and Reel
C27 C28 C35 = C1005X5R1A105K050BB: MLCC 1 uF, +/- 10%, 10 V, -55 to 85 degC, 0402 (1005 Metric), RoHS, Tape and Reel; Manufacturer: TDK; PCN Part Number: MLCCPartNumberChange30/Nov/2012; Product Training Modules: CSeriesGeneralApplicationsSEAT,CCV,andTVCLDesignToolsGuidetoReplacinganElectrolyticCapacitorwithanMLCC; Voltage - Rated: 10V; Temperature Coefficient: X5R; Online Catalog: CSeries,GeneralPurpose; Other Names: 445-4114-6; Category: Capacitors; Features: -; Lead Style: -; RoHS Information: RoHSCertificate-MLCC; Manufacturer URL: http://www.tdk.com/; Lead Spacing: -; Thickness (Max): 0.022"(0.55mm); Applications: GeneralPurpose; Tolerance: ±10%; Mounting Technology: SurfaceMount; Mounting Type: SurfaceMount,MLCC; Operating Temperature: -55°C~85°C; Datasheet URL: http://download.siliconexpert.com/pdfs/2015/4/21/15/54/45/779/tdk_/manual/37024850441143360mlcc_commercial_general_en.pdf; Package Reference: 1005; Height - Seated (Max): -; Family: CeramicCapacitors; Datasheet Version: 03/2015; Package Description: 2-Pin Surface Mount Device, Body 1 x 0.5 mm; Packaging: Digi-Reel®; Size / Dimension: 0.039"Lx0.020"W(1.00mmx0.50mm); Standard Package: 1; Package / Case: 0402(1005Metric); Ratings: -; Series: C; Part Number: C1005X5R1A105K050BB
C29-C32 C36 = C1005X7R1H104K050BB: as C18 on sheet POWER; Voltage: 50V; Min Operating Temperature: -55°C; Depth: 0.5mm; Radiation Hardening: No; RoHS Compliant: Yes; Voltage Rating (DC): 50V; Lead Free: Lead Free; Resistor Type: Ceramic; Height: 0.5mm; Dielectric: X7R; Thickness: 0.022inch; Case/Package: 0402; Case Code (Metric): 1005; Termination: SMD/SMT; Packaging: Tape and Reel; Max Operating Temperature: 125°C; Mount: Surface Mount; Package Quantity: 1; Width: 0.02inch; Weight: 2.3E-05oz; Voltage Rating: 50V; Tolerance: 10%; Construction: Flat; Case Code (Imperial): 0402; Length: 1mm; REACH SVHC: No SVHC; Series: C; Part Number: C1005X7R1H104K050BB
D2 D10 D11 = CMP-04985-000007-1: TVS DIODE 5.5V 14V 2X1SON; Capacitance: 0.42pF; Number of Bidirectional Channels: 1; Max Power Dissipation: 40W; Test Current: 1mA; ESD Protection: Yes; Element Configuration: Single; Breakdown Voltage: 6.5V; Polarity: Bidirectional; Min Breakdown Voltage: 6V; Max Reverse Leakage Current: 10nA; Direction: Unidirectional; Peak Pulse Current: 2.5A; Interface: LVDS; Max Operating Temperature: 125°C; Mount: Surface Mount; Lead Free: Lead Free; Termination: SMD/SMT; Packaging: Tape and Reel; Clamping Voltage: 14V; Case/Package: 0402; Peak Pulse Power: 40W; Reverse Standoff Voltage: 5.5V; Height: 0.4mm; Number of Channels: 1; Working Voltage: 5.5V; Power Line Protection: Yes; Number of Pins: 2; Length: 1.1mm; Leakage Current: 10nA; Operating Supply Voltage: 5.5V; Radiation Hardening: No; Package Quantity: 250; REACH SVHC: No SVHC; Width: 0.7mm; Min Operating Temperature: -40°C
D9 = CMP-22017-000029-1: as D3 on sheet POWER; Case/Package: 0603; Package Quantity: 1; Illumination Color: Green; Lens Style: Clear; Lens Transparency: Clear; Depth: 0.8mm; Power Rating: 100mW; Width: 0.8mm; Height: 0.55mm; Radiation Hardening: No; Case Code (Imperial): 0603; Number of Pins: 2; Length: 1.6mm; Case Code (Metric): 1608; Max Operating Temperature: 85°C; Packaging: Tape and Reel; Mount: Surface Mount; Min Operating Temperature: -55°C; Lead Free: Lead Free; Number of LEDs: 1
IC1 = NTS0102GT: Integrated Circuit; Manufacturer_Name: NXP; Datasheet Link: https://www.nxp.com/docs/en/data-sheet/NTS0102.pdf; Height: 0.5mm; Manufacturer_Part_Number: NTS0102GT; Mouser Part Number: N/A; Mouser Price/Stock: https://www.mouser.co.uk/ProductDetail/NXP-Semiconductors/NTS0102GT?qs=fAHHVMwC%252BbiEwQ74lfEnvg%3D%3D
J = BNC7T-J-P-XX-ST-EM1D: BNC Connector Jack, Female Socket 75Ohm Board Edge, End Launch; Panel Mount Solder; MP: BNC7T-J-P-GN-ST-EM1D; MF: Samtec Inc.; Package: None; DigiKey-Purchase-URL: https://snapeda.com/shop?store=DigiKey&id=3266999; Price: None; SnapEDA_Link: https://www.snapeda.com/parts/BNC7T-J-P-GN-ST-EM1D/Samtec%20Inc./view-part/3266999/?ref=snap; Toby_UK-Purchase-URL: https://snapeda.com/shop?store=Toby+UK&id=3266999; Value: *; Availability: Unavailable
J3 = CMP-04776-000105-1: CONN HEADER SMD 4POS 1.25MM; Manufacturer: Molex; Conn Gender: Male; Conn Orientation: Vertical; Standoff Height: 0.05mm; Number Of Contacts: 4; Current Rating: 1A; Voltage Rating: 125V; Package: 0; ComponentLink2Description: Datasheet; ComponentLink2URL: https://www.molex.com/pdm_docs/ps/PS-51021-024-001.pdf; Ambient Temperature Range Low: -40°C; Category: Conn; Automotive: No; Number Of Rows: 1; Device Class L3: unset; Ambient Temperature Range High: +105°C; Height: 5.1mm; Lead Free: Yes; Pitch: 1.25mm; Contact Material: Tin; Footprint Url: https://www.molex.com/pdm_docs/sd/533980471_sd.pdf; Octopart: https://octopart.com/53398-0471-molex-655296; Temperature Range Low: -40°C; Device Class L2: Headers and Wire Housings; Temperature: -40°C to +105°C; Digikey Description: CONN HEADER SMD 4POS 1.25MM; RoHS: TRUE; Manufacturer Part Number: 533980471; Device Class L1: Connectors; Temperature Range High: +105°C
L3 = LMH0397RTVR: The LMH0397 is a 3G-SDI 75-Ω bidirectional I/O with integrated reclocker.; Manufacturer_Name: Texas Instruments; Datasheet Link: https://www.ti.com/lit/ds/symlink/lmh0397.pdf?HQS=dis-dk-null-digikeymode-dsf-pf-null-wwe&ts=1630762637746; Height: 0.8mm; Manufacturer_Part_Number: LMH0397RTVR; Mouser Part Number: 595-LMH0397RTVR; Mouser Price/Stock: https://www.mouser.co.uk/ProductDetail/Texas-Instruments/LMH0397RTVR?qs=5aG0NVq1C4zpBN83bcpBMQ%3D%3D; Arrow Part Number: LMH0397RTVR; Arrow Price/Stock: https://www.arrow.com/en/products/lmh0397rtvr/texas-instruments?utm_currency=USD&region=nac
R1 R3 R12-R16 R19 R34-R37 = CMP-2002-07353-1: Part Number: RC0402FR-070RL; Manufacturer: Yageo / Phycomp
R25-R27 = CMP-2002-07798-1: Manufacturer: Yageo / Phycomp; Part Number: RC0402FR-0775RL
R43 R44 = CMP-2002-07353-1: Manufacturer: Yageo / Phycomp; Part Number: RC0402FR-0710KL
SW1 SW2 = CMP-03913-99472344-3: Slide Switch, 0.3A, 5Vdc, Smd Rohs Compliant: Yes; Manufacturer Lifecycle Status: ACTIVE; Current Rating: 300mA; YEOL: 1 = Estimated lifetime > 10 years; Insulation Resistance: 100MΩ; Voltage Rating: 5V; Max Operating Temperature: 85°C; Min Operating Temperature: -40°C; Packaging: Tape and Reel; Lifecycle Status: Production; RoHS: Compliant; Contact Plating: Silver

## Nets that join several sheets
+2V5: POWER (R23.1 R30.1), CONVERTER (19 pins)
+3V3: POWER (R2.1 R24.1), OPTIC (13 pins), CONVERTER (C32.1 D11.2 IC1.7 J3.3)
GND: POWER (22 pins), OPTIC (28 pins), CONVERTER (32 pins)
I2C_SCL: OPTIC (M1.5 R7.2), CONVERTER (D10.2 IC1.1 J3.2)
I2C_SDA: OPTIC (M1.4 R8.2), CONVERTER (D2.2 IC1.8 J3.1)
RD_N: OPTIC (M1.12), CONVERTER (C39.1)
RD_P: OPTIC (M1.13), CONVERTER (C38.1)
TD_N: OPTIC (M1.19), CONVERTER (C41.1)
TD_P: OPTIC (M1.18), CONVERTER (C40.1)